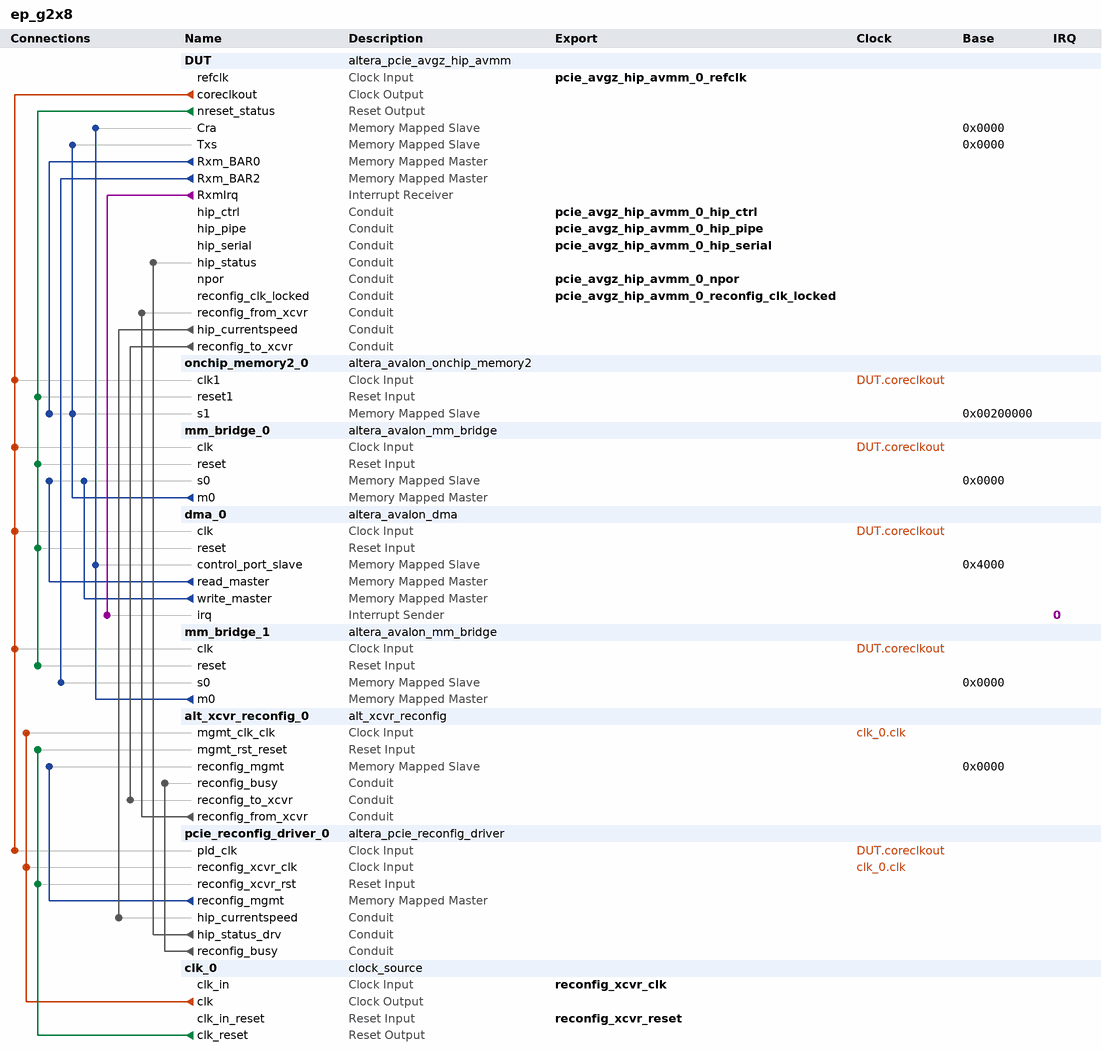
[diagram p0: system contents]
# Platform Designer (Qsys) system ep_g2x8, Arria V GZ Unknown
# Parameters at their usual value, and those the tool derives, are not listed.
package require -exact qsys 15.0
create_system ep_g2x8
set_project_property DEVICE_FAMILY {Arria V GZ}
set_project_property DEVICE Unknown

add_instance DUT altera_pcie_avgz_hip_avmm 15.0
set_instance_parameter_value DUT AST_LITE 0
set_instance_parameter_value DUT AVALON_ADDR_WIDTH 32
set_instance_parameter_value DUT AddressPage "0\\,1\\,2\\,3\\,4\\,5\\,6\\,7\\,8\\,9\\,10\\,11\\,12\\,13\\,14\\,15"
set_instance_parameter_value DUT BYPASSS_A2P_TRANSLATION 0
set_instance_parameter_value DUT CB_A2P_ADDR_MAP_FIXED_TABLE_0_HIGH 0
set_instance_parameter_value DUT CB_A2P_ADDR_MAP_FIXED_TABLE_0_LOW 0
set_instance_parameter_value DUT CB_A2P_ADDR_MAP_FIXED_TABLE_10_HIGH 0
set_instance_parameter_value DUT CB_A2P_ADDR_MAP_FIXED_TABLE_10_LOW 0
set_instance_parameter_value DUT CB_A2P_ADDR_MAP_FIXED_TABLE_11_HIGH 0
set_instance_parameter_value DUT CB_A2P_ADDR_MAP_FIXED_TABLE_11_LOW 0
set_instance_parameter_value DUT CB_A2P_ADDR_MAP_FIXED_TABLE_12_HIGH 0
set_instance_parameter_value DUT CB_A2P_ADDR_MAP_FIXED_TABLE_12_LOW 0
set_instance_parameter_value DUT CB_A2P_ADDR_MAP_FIXED_TABLE_13_HIGH 0
set_instance_parameter_value DUT CB_A2P_ADDR_MAP_FIXED_TABLE_13_LOW 0
set_instance_parameter_value DUT CB_A2P_ADDR_MAP_FIXED_TABLE_14_HIGH 0
set_instance_parameter_value DUT CB_A2P_ADDR_MAP_FIXED_TABLE_14_LOW 0
set_instance_parameter_value DUT CB_A2P_ADDR_MAP_FIXED_TABLE_15_HIGH 0
set_instance_parameter_value DUT CB_A2P_ADDR_MAP_FIXED_TABLE_15_LOW 0
set_instance_parameter_value DUT CB_A2P_ADDR_MAP_FIXED_TABLE_1_HIGH 0
set_instance_parameter_value DUT CB_A2P_ADDR_MAP_FIXED_TABLE_1_LOW 0
set_instance_parameter_value DUT CB_A2P_ADDR_MAP_FIXED_TABLE_2_HIGH 0
set_instance_parameter_value DUT CB_A2P_ADDR_MAP_FIXED_TABLE_2_LOW 0
set_instance_parameter_value DUT CB_A2P_ADDR_MAP_FIXED_TABLE_3_HIGH 0
set_instance_parameter_value DUT CB_A2P_ADDR_MAP_FIXED_TABLE_3_LOW 0
set_instance_parameter_value DUT CB_A2P_ADDR_MAP_FIXED_TABLE_4_HIGH 0
set_instance_parameter_value DUT CB_A2P_ADDR_MAP_FIXED_TABLE_4_LOW 0
set_instance_parameter_value DUT CB_A2P_ADDR_MAP_FIXED_TABLE_5_HIGH 0
set_instance_parameter_value DUT CB_A2P_ADDR_MAP_FIXED_TABLE_5_LOW 0
set_instance_parameter_value DUT CB_A2P_ADDR_MAP_FIXED_TABLE_6_HIGH 0
set_instance_parameter_value DUT CB_A2P_ADDR_MAP_FIXED_TABLE_6_LOW 0
set_instance_parameter_value DUT CB_A2P_ADDR_MAP_FIXED_TABLE_7_HIGH 0
set_instance_parameter_value DUT CB_A2P_ADDR_MAP_FIXED_TABLE_7_LOW 0
set_instance_parameter_value DUT CB_A2P_ADDR_MAP_FIXED_TABLE_8_HIGH 0
set_instance_parameter_value DUT CB_A2P_ADDR_MAP_FIXED_TABLE_8_LOW 0
set_instance_parameter_value DUT CB_A2P_ADDR_MAP_FIXED_TABLE_9_HIGH 0
set_instance_parameter_value DUT CB_A2P_ADDR_MAP_FIXED_TABLE_9_LOW 0
set_instance_parameter_value DUT CB_A2P_ADDR_MAP_IS_FIXED 1
set_instance_parameter_value DUT CB_A2P_ADDR_MAP_NUM_ENTRIES 2
set_instance_parameter_value DUT CB_A2P_ADDR_MAP_PASS_THRU_BITS 20
set_instance_parameter_value DUT CB_P2A_AVALON_ADDR_B0 0x00000000
set_instance_parameter_value DUT CB_P2A_AVALON_ADDR_B1 0x00000000
set_instance_parameter_value DUT CB_P2A_AVALON_ADDR_B2 0x00000000
set_instance_parameter_value DUT CB_P2A_AVALON_ADDR_B3 0x00000000
set_instance_parameter_value DUT CB_P2A_AVALON_ADDR_B4 0x00000000
set_instance_parameter_value DUT CB_P2A_AVALON_ADDR_B5 0x00000000
set_instance_parameter_value DUT CB_P2A_FIXED_AVALON_ADDR_B0 0
set_instance_parameter_value DUT CB_P2A_FIXED_AVALON_ADDR_B1 0
set_instance_parameter_value DUT CB_P2A_FIXED_AVALON_ADDR_B2 0
set_instance_parameter_value DUT CB_P2A_FIXED_AVALON_ADDR_B3 0
set_instance_parameter_value DUT CB_P2A_FIXED_AVALON_ADDR_B4 0
set_instance_parameter_value DUT CB_P2A_FIXED_AVALON_ADDR_B5 0
set_instance_parameter_value DUT CB_PCIE_MODE 0
set_instance_parameter_value DUT CB_PCIE_RX_LITE 0
set_instance_parameter_value DUT CB_RP_S_ADDR_WIDTH 32
set_instance_parameter_value DUT CG_COMMON_CLOCK_MODE 1
set_instance_parameter_value DUT CG_ENABLE_A2P_INTERRUPT 0
set_instance_parameter_value DUT CG_ENABLE_ADVANCED_INTERRUPT 0
set_instance_parameter_value DUT CG_ENABLE_HIP_STATUS 1
set_instance_parameter_value DUT CG_ENABLE_HIP_STATUS_EXTENSION 0
set_instance_parameter_value DUT CG_IMPL_CRA_AV_SLAVE_PORT 1
set_instance_parameter_value DUT CG_RXM_IRQ_NUM 16
set_instance_parameter_value DUT NUM_PREFETCH_MASTERS 1
set_instance_parameter_value DUT PCIeAddress31_0 "0x00000000\\,0x00000000\\,0x00000000\\,0x00000000\\,0x00000000\\,0x00000000\\,0x00000000\\,0x00000000\\,0x00000000\\,0x00000000\\,0x00000000\\,0x00000000\\,0x00000000\\,0x00000000\\,0x00000000\\,0x00000000"
set_instance_parameter_value DUT PCIeAddress63_32 "0x00000000\\,0x00000000\\,0x00000000\\,0x00000000\\,0x00000000\\,0x00000000\\,0x00000000\\,0x00000000\\,0x00000000\\,0x00000000\\,0x00000000\\,0x00000000\\,0x00000000\\,0x00000000\\,0x00000000\\,0x00000000"
set_instance_parameter_value DUT RXM_BEN_WIDTH 8
set_instance_parameter_value DUT RXM_DATA_WIDTH 64
set_instance_parameter_value DUT SLAVE_ADDRESS_MAP_0 22
set_instance_parameter_value DUT SLAVE_ADDRESS_MAP_1 0
set_instance_parameter_value DUT SLAVE_ADDRESS_MAP_2 15
set_instance_parameter_value DUT SLAVE_ADDRESS_MAP_3 0
set_instance_parameter_value DUT SLAVE_ADDRESS_MAP_4 0
set_instance_parameter_value DUT SLAVE_ADDRESS_MAP_5 0
set_instance_parameter_value DUT TX_S_ADDR_WIDTH 32
set_instance_parameter_value DUT advanced_default_hwtcl_atomic_malformed true
set_instance_parameter_value DUT advanced_default_hwtcl_atomic_op_completer_32bit false
set_instance_parameter_value DUT advanced_default_hwtcl_atomic_op_completer_64bit false
set_instance_parameter_value DUT advanced_default_hwtcl_atomic_op_routing false
set_instance_parameter_value DUT advanced_default_hwtcl_bridge_port_ssid_support false
set_instance_parameter_value DUT advanced_default_hwtcl_bridge_port_vga_enable false
set_instance_parameter_value DUT advanced_default_hwtcl_bypass_cdc false
set_instance_parameter_value DUT advanced_default_hwtcl_cas_completer_128bit false
set_instance_parameter_value DUT advanced_default_hwtcl_cdc_dummy_insert_limit 11
set_instance_parameter_value DUT advanced_default_hwtcl_d0_pme false
set_instance_parameter_value DUT advanced_default_hwtcl_d1_pme false
set_instance_parameter_value DUT advanced_default_hwtcl_d1_support false
set_instance_parameter_value DUT advanced_default_hwtcl_d2_pme false
set_instance_parameter_value DUT advanced_default_hwtcl_d2_support false
set_instance_parameter_value DUT advanced_default_hwtcl_d3_cold_pme false
set_instance_parameter_value DUT advanced_default_hwtcl_d3_hot_pme false
set_instance_parameter_value DUT advanced_default_hwtcl_data_pack_rx disable
set_instance_parameter_value DUT advanced_default_hwtcl_deskew_comma com_deskw
set_instance_parameter_value DUT advanced_default_hwtcl_device_number 0
set_instance_parameter_value DUT advanced_default_hwtcl_disable_link_x2_support false
set_instance_parameter_value DUT advanced_default_hwtcl_disable_snoop_packet false
set_instance_parameter_value DUT advanced_default_hwtcl_ei_delay_powerdown_count 10
set_instance_parameter_value DUT advanced_default_hwtcl_eie_before_nfts_count 4
set_instance_parameter_value DUT advanced_default_hwtcl_enable_adapter_half_rate_mode false
set_instance_parameter_value DUT advanced_default_hwtcl_enable_l1_aspm false
set_instance_parameter_value DUT advanced_default_hwtcl_enable_rx_buffer_checking false
set_instance_parameter_value DUT advanced_default_hwtcl_extended_format_field false
set_instance_parameter_value DUT advanced_default_hwtcl_extended_tag_reset false
set_instance_parameter_value DUT advanced_default_hwtcl_fc_init_timer 1024
set_instance_parameter_value DUT advanced_default_hwtcl_flow_control_timeout_count 200
set_instance_parameter_value DUT advanced_default_hwtcl_flow_control_update_count 30
set_instance_parameter_value DUT advanced_default_hwtcl_flr_capability false
set_instance_parameter_value DUT advanced_default_hwtcl_gen2_diffclock_nfts_count 255
set_instance_parameter_value DUT advanced_default_hwtcl_gen2_sameclock_nfts_count 255
set_instance_parameter_value DUT advanced_default_hwtcl_hot_plug_support 0
set_instance_parameter_value DUT advanced_default_hwtcl_interrupt_pin inta
set_instance_parameter_value DUT advanced_default_hwtcl_l01_entry_latency 31
set_instance_parameter_value DUT advanced_default_hwtcl_l0_exit_latency_diffclock 6
set_instance_parameter_value DUT advanced_default_hwtcl_l0_exit_latency_sameclock 6
set_instance_parameter_value DUT advanced_default_hwtcl_l1_exit_latency_diffclock 0
set_instance_parameter_value DUT advanced_default_hwtcl_l1_exit_latency_sameclock 0
set_instance_parameter_value DUT advanced_default_hwtcl_low_priority_vc single_vc
set_instance_parameter_value DUT advanced_default_hwtcl_ltr_mechanism false
set_instance_parameter_value DUT advanced_default_hwtcl_ltssm_1ms_timeout disable
set_instance_parameter_value DUT advanced_default_hwtcl_ltssm_freqlocked_check disable
set_instance_parameter_value DUT advanced_default_hwtcl_maximum_current 0
set_instance_parameter_value DUT advanced_default_hwtcl_no_command_completed true
set_instance_parameter_value DUT advanced_default_hwtcl_no_soft_reset false
set_instance_parameter_value DUT advanced_default_hwtcl_pclk_out_sel pclk
set_instance_parameter_value DUT advanced_default_hwtcl_pipex1_debug_sel disable
set_instance_parameter_value DUT advanced_default_hwtcl_register_pipe_signals false
set_instance_parameter_value DUT advanced_default_hwtcl_reserved_debug 0
set_instance_parameter_value DUT advanced_default_hwtcl_retry_buffer_last_active_address 2047
set_instance_parameter_value DUT advanced_default_hwtcl_rx_l0s_count_idl 0
set_instance_parameter_value DUT advanced_default_hwtcl_set_l0s 0
set_instance_parameter_value DUT advanced_default_hwtcl_skp_os_gen3_count 0
set_instance_parameter_value DUT advanced_default_hwtcl_skp_os_schedule_count 0
set_instance_parameter_value DUT advanced_default_hwtcl_ssid 0
set_instance_parameter_value DUT advanced_default_hwtcl_ssvid 0
set_instance_parameter_value DUT advanced_default_hwtcl_tph_completer false
set_instance_parameter_value DUT advanced_default_hwtcl_tx_cdc_almost_empty 5
set_instance_parameter_value DUT advanced_default_hwtcl_vc0_clk_enable true
set_instance_parameter_value DUT advanced_default_hwtcl_wrong_device_id disable
set_instance_parameter_value DUT advanced_default_parameter_override 0
set_instance_parameter_value DUT avmm_width_hwtcl 128
set_instance_parameter_value DUT bar0_type_hwtcl 1
set_instance_parameter_value DUT bar1_type_hwtcl 0
set_instance_parameter_value DUT bar2_type_hwtcl 2
set_instance_parameter_value DUT bar3_type_hwtcl 0
set_instance_parameter_value DUT bar4_type_hwtcl 0
set_instance_parameter_value DUT bar5_type_hwtcl 0
set_instance_parameter_value DUT bypass_tl false
set_instance_parameter_value DUT class_code_hwtcl 0
set_instance_parameter_value DUT completion_timeout_hwtcl ABCD
set_instance_parameter_value DUT device_id_hwtcl 1
set_instance_parameter_value DUT dll_active_report_support_hwtcl 0
set_instance_parameter_value DUT ecrc_check_capable_hwtcl 0
set_instance_parameter_value DUT ecrc_gen_capable_hwtcl 0
set_instance_parameter_value DUT enable_completion_timeout_disable_hwtcl 1
set_instance_parameter_value DUT enable_function_msix_support_hwtcl 0
set_instance_parameter_value DUT enable_pcisigtest_hwtcl 0
set_instance_parameter_value DUT enable_power_on_rst_pulse_hwtcl 0
set_instance_parameter_value DUT enable_slot_register_hwtcl 0
set_instance_parameter_value DUT enable_tl_only_sim_hwtcl 0
set_instance_parameter_value DUT endpoint_l0_latency_hwtcl 0
set_instance_parameter_value DUT endpoint_l1_latency_hwtcl 0
set_instance_parameter_value DUT expansion_base_address_register_hwtcl 0
set_instance_parameter_value DUT extend_tag_field_hwtcl 32
set_instance_parameter_value DUT fixed_address_mode 0
set_instance_parameter_value DUT force_hrc 0
set_instance_parameter_value DUT force_src 0
set_instance_parameter_value DUT gen123_lane_rate_mode_hwtcl {Gen2 (5.0 Gbps)}
set_instance_parameter_value DUT gen3_rxfreqlock_counter_hwtcl 0
set_instance_parameter_value DUT hip_reconfig_hwtcl 0
set_instance_parameter_value DUT hip_tag_checking_hwtcl 1
set_instance_parameter_value DUT hwtcl_override_g2_txvod 1
set_instance_parameter_value DUT in_cvp_mode_hwtcl 0
set_instance_parameter_value DUT io_window_addr_width_hwtcl 0
set_instance_parameter_value DUT lane_mask_hwtcl x8
set_instance_parameter_value DUT max_payload_size_hwtcl 128
set_instance_parameter_value DUT msi_64bit_addressing_capable_hwtcl true
set_instance_parameter_value DUT msi_masking_capable_hwtcl false
set_instance_parameter_value DUT msi_multi_message_capable_hwtcl 4
set_instance_parameter_value DUT msi_support_hwtcl true
set_instance_parameter_value DUT msix_pba_bir_hwtcl 0
set_instance_parameter_value DUT msix_pba_offset_hwtcl 0
set_instance_parameter_value DUT msix_table_bir_hwtcl 0
set_instance_parameter_value DUT msix_table_offset_hwtcl 0
set_instance_parameter_value DUT msix_table_size_hwtcl 0
set_instance_parameter_value DUT override_rxbuffer_cred_preset 0
set_instance_parameter_value DUT override_tbpartner_driver_setting_hwtcl 0
set_instance_parameter_value DUT pcie_inspector_hwtcl 0
set_instance_parameter_value DUT pcie_qsys 1
set_instance_parameter_value DUT pll_refclk_freq_hwtcl {100 MHz}
set_instance_parameter_value DUT port_link_number_hwtcl 1
set_instance_parameter_value DUT port_type_hwtcl {Native endpoint}
set_instance_parameter_value DUT prefetchable_mem_window_addr_width_hwtcl 0
set_instance_parameter_value DUT revision_id_hwtcl 1
set_instance_parameter_value DUT rpre_emph_a_val_hwtcl 9
set_instance_parameter_value DUT rpre_emph_b_val_hwtcl 0
set_instance_parameter_value DUT rpre_emph_c_val_hwtcl 16
set_instance_parameter_value DUT rpre_emph_d_val_hwtcl 13
set_instance_parameter_value DUT rpre_emph_e_val_hwtcl 5
set_instance_parameter_value DUT rvod_sel_a_val_hwtcl 42
set_instance_parameter_value DUT rvod_sel_b_val_hwtcl 38
set_instance_parameter_value DUT rvod_sel_c_val_hwtcl 38
set_instance_parameter_value DUT rvod_sel_d_val_hwtcl 43
set_instance_parameter_value DUT rvod_sel_e_val_hwtcl 15
set_instance_parameter_value DUT rxbuffer_rxreq_hwtcl Low
set_instance_parameter_value DUT serial_sim_hwtcl 0
set_instance_parameter_value DUT set_pld_clk_x1_625MHz_hwtcl 0
set_instance_parameter_value DUT slot_number_hwtcl 0
set_instance_parameter_value DUT slot_power_limit_hwtcl 0
set_instance_parameter_value DUT slot_power_scale_hwtcl 0
set_instance_parameter_value DUT slotclkcfg_hwtcl 1
set_instance_parameter_value DUT subsystem_device_id_hwtcl 0
set_instance_parameter_value DUT subsystem_vendor_id_hwtcl 0
set_instance_parameter_value DUT surprise_down_error_support_hwtcl 0
set_instance_parameter_value DUT tlp_insp_trg_dw0_hwtcl 1
set_instance_parameter_value DUT tlp_insp_trg_dw1_hwtcl 0
set_instance_parameter_value DUT tlp_insp_trg_dw2_hwtcl 0
set_instance_parameter_value DUT tlp_insp_trg_dw3_hwtcl 0
set_instance_parameter_value DUT tlp_inspector_hwtcl 0
set_instance_parameter_value DUT tlp_inspector_use_signal_probe_hwtcl 0
set_instance_parameter_value DUT use_aer_hwtcl 0
set_instance_parameter_value DUT use_ast_parity 0
set_instance_parameter_value DUT use_atx_pll_hwtcl 0
set_instance_parameter_value DUT use_crc_forwarding_hwtcl 0
set_instance_parameter_value DUT use_cvp_update_core_pof_hwtcl 0
set_instance_parameter_value DUT use_rx_st_be_hwtcl 0
set_instance_parameter_value DUT vendor_id_hwtcl 0
set_instance_parameter_value DUT vsec_id_hwtcl 40960
set_instance_parameter_value DUT vsec_rev_hwtcl 0

add_instance onchip_memory2_0 altera_avalon_onchip_memory2 15.0
set_instance_parameter_value onchip_memory2_0 dataWidth 128
set_instance_parameter_value onchip_memory2_0 dualPort false
set_instance_parameter_value onchip_memory2_0 initMemContent false
set_instance_parameter_value onchip_memory2_0 initializationFileName onchip_memory2_0
set_instance_parameter_value onchip_memory2_0 memorySize 4096

add_instance mm_bridge_0 altera_avalon_mm_bridge 15.0
set_instance_parameter_value mm_bridge_0 ADDRESS_UNITS SYMBOLS
set_instance_parameter_value mm_bridge_0 ADDRESS_WIDTH 22
set_instance_parameter_value mm_bridge_0 DATA_WIDTH 128
set_instance_parameter_value mm_bridge_0 MAX_BURST_SIZE 64
set_instance_parameter_value mm_bridge_0 MAX_PENDING_RESPONSES 8
set_instance_parameter_value mm_bridge_0 PIPELINE_RESPONSE 0
set_instance_parameter_value mm_bridge_0 USE_AUTO_ADDRESS_WIDTH 0

add_instance dma_0 altera_avalon_dma 15.0
set_instance_parameter_value dma_0 allowByteTransactions false
set_instance_parameter_value dma_0 allowDoubleWordTransactions true
set_instance_parameter_value dma_0 allowHalfWordTransactions false
set_instance_parameter_value dma_0 allowQuadWordTransactions true
set_instance_parameter_value dma_0 allowWordTransactions false
set_instance_parameter_value dma_0 burstEnable true
set_instance_parameter_value dma_0 fifoDepth 16
set_instance_parameter_value dma_0 maxBurstSize 64
set_instance_parameter_value dma_0 minimumDmaTransactionRegisterWidth 13

add_instance mm_bridge_1 altera_avalon_mm_bridge 15.0
set_instance_parameter_value mm_bridge_1 ADDRESS_UNITS SYMBOLS
set_instance_parameter_value mm_bridge_1 ADDRESS_WIDTH 15
set_instance_parameter_value mm_bridge_1 DATA_WIDTH 128
set_instance_parameter_value mm_bridge_1 MAX_PENDING_RESPONSES 1
set_instance_parameter_value mm_bridge_1 PIPELINE_COMMAND 0
set_instance_parameter_value mm_bridge_1 USE_AUTO_ADDRESS_WIDTH 0

add_instance alt_xcvr_reconfig_0 alt_xcvr_reconfig 15.0
set_instance_parameter_value alt_xcvr_reconfig_0 device_family {Arria V GZ}
set_instance_parameter_value alt_xcvr_reconfig_0 enable_adce 0
set_instance_parameter_value alt_xcvr_reconfig_0 enable_analog 1
set_instance_parameter_value alt_xcvr_reconfig_0 number_of_reconfig_interfaces 10

add_instance pcie_reconfig_driver_0 altera_pcie_reconfig_driver 15.0
set_instance_parameter_value pcie_reconfig_driver_0 gen123_lane_rate_mode_hwtcl {Gen2 (5.0 Gbps)}
set_instance_parameter_value pcie_reconfig_driver_0 number_of_reconfig_interfaces 10

add_instance clk_0 clock_source 15.0
set_instance_parameter_value clk_0 clockFrequency 125000000

# connections
add_connection clk_0.clk alt_xcvr_reconfig_0.mgmt_clk_clk clock
add_connection clk_0.clk pcie_reconfig_driver_0.reconfig_xcvr_clk clock
add_connection DUT.coreclkout dma_0.clk clock
add_connection DUT.coreclkout mm_bridge_0.clk clock
add_connection DUT.coreclkout mm_bridge_1.clk clock
add_connection DUT.coreclkout onchip_memory2_0.clk1 clock
add_connection DUT.coreclkout pcie_reconfig_driver_0.pld_clk clock
add_connection clk_0.clk_reset alt_xcvr_reconfig_0.mgmt_rst_reset reset
add_connection clk_0.clk_reset pcie_reconfig_driver_0.reconfig_xcvr_rst reset
add_connection DUT.nreset_status dma_0.reset reset
add_connection DUT.nreset_status mm_bridge_0.reset reset
add_connection DUT.nreset_status mm_bridge_1.reset reset
add_connection DUT.nreset_status onchip_memory2_0.reset1 reset
add_connection dma_0.read_master mm_bridge_0.s0 avalon
set_connection_parameter_value dma_0.read_master/mm_bridge_0.s0 baseAddress 0x0000
add_connection dma_0.write_master mm_bridge_0.s0 avalon
set_connection_parameter_value dma_0.write_master/mm_bridge_0.s0 baseAddress 0x0000
add_connection DUT.Rxm_BAR0 onchip_memory2_0.s1 avalon
set_connection_parameter_value DUT.Rxm_BAR0/onchip_memory2_0.s1 baseAddress 0x00200000
add_connection DUT.Rxm_BAR2 mm_bridge_1.s0 avalon
set_connection_parameter_value DUT.Rxm_BAR2/mm_bridge_1.s0 baseAddress 0x0000
add_connection mm_bridge_0.m0 DUT.Txs avalon
set_connection_parameter_value mm_bridge_0.m0/DUT.Txs baseAddress 0x0000
add_connection mm_bridge_0.m0 onchip_memory2_0.s1 avalon
set_connection_parameter_value mm_bridge_0.m0/onchip_memory2_0.s1 baseAddress 0x00200000
add_connection mm_bridge_1.m0 dma_0.control_port_slave avalon
set_connection_parameter_value mm_bridge_1.m0/dma_0.control_port_slave baseAddress 0x4000
add_connection mm_bridge_1.m0 DUT.Cra avalon
set_connection_parameter_value mm_bridge_1.m0/DUT.Cra baseAddress 0x0000
add_connection pcie_reconfig_driver_0.reconfig_mgmt alt_xcvr_reconfig_0.reconfig_mgmt avalon
set_connection_parameter_value pcie_reconfig_driver_0.reconfig_mgmt/alt_xcvr_reconfig_0.reconfig_mgmt baseAddress 0x0000
add_connection alt_xcvr_reconfig_0.reconfig_from_xcvr DUT.reconfig_from_xcvr conduit
add_connection DUT.hip_currentspeed pcie_reconfig_driver_0.hip_currentspeed conduit
add_connection DUT.reconfig_to_xcvr alt_xcvr_reconfig_0.reconfig_to_xcvr conduit
add_connection pcie_reconfig_driver_0.hip_status_drv DUT.hip_status conduit
add_connection pcie_reconfig_driver_0.reconfig_busy alt_xcvr_reconfig_0.reconfig_busy conduit
add_connection DUT.RxmIrq dma_0.irq interrupt
set_connection_parameter_value DUT.RxmIrq/dma_0.irq irqNumber 0

# exported interfaces
add_interface pcie_avgz_hip_avmm_0_hip_ctrl conduit end
set_interface_property pcie_avgz_hip_avmm_0_hip_ctrl EXPORT_OF DUT.hip_ctrl
add_interface pcie_avgz_hip_avmm_0_hip_pipe conduit end
set_interface_property pcie_avgz_hip_avmm_0_hip_pipe EXPORT_OF DUT.hip_pipe
add_interface pcie_avgz_hip_avmm_0_hip_serial conduit end
set_interface_property pcie_avgz_hip_avmm_0_hip_serial EXPORT_OF DUT.hip_serial
add_interface pcie_avgz_hip_avmm_0_npor conduit end
set_interface_property pcie_avgz_hip_avmm_0_npor EXPORT_OF DUT.npor
add_interface pcie_avgz_hip_avmm_0_reconfig_clk_locked conduit end
set_interface_property pcie_avgz_hip_avmm_0_reconfig_clk_locked EXPORT_OF DUT.reconfig_clk_locked
add_interface pcie_avgz_hip_avmm_0_refclk clock sink
set_interface_property pcie_avgz_hip_avmm_0_refclk EXPORT_OF DUT.refclk
add_interface reconfig_xcvr_clk clock sink
set_interface_property reconfig_xcvr_clk EXPORT_OF clk_0.clk_in
add_interface reconfig_xcvr_reset reset sink
set_interface_property reconfig_xcvr_reset EXPORT_OF clk_0.clk_in_reset

set_interconnect_requirement {$system} qsys_mm.clockCrossingAdapter AUTO
set_interconnect_requirement {$system} qsys_mm.maxAdditionalLatency 3

save_system ep_g2x8.qsys
